# EAGLE design ProgrammateurFilPilote_1.2 (EAGLE 6.6.0)
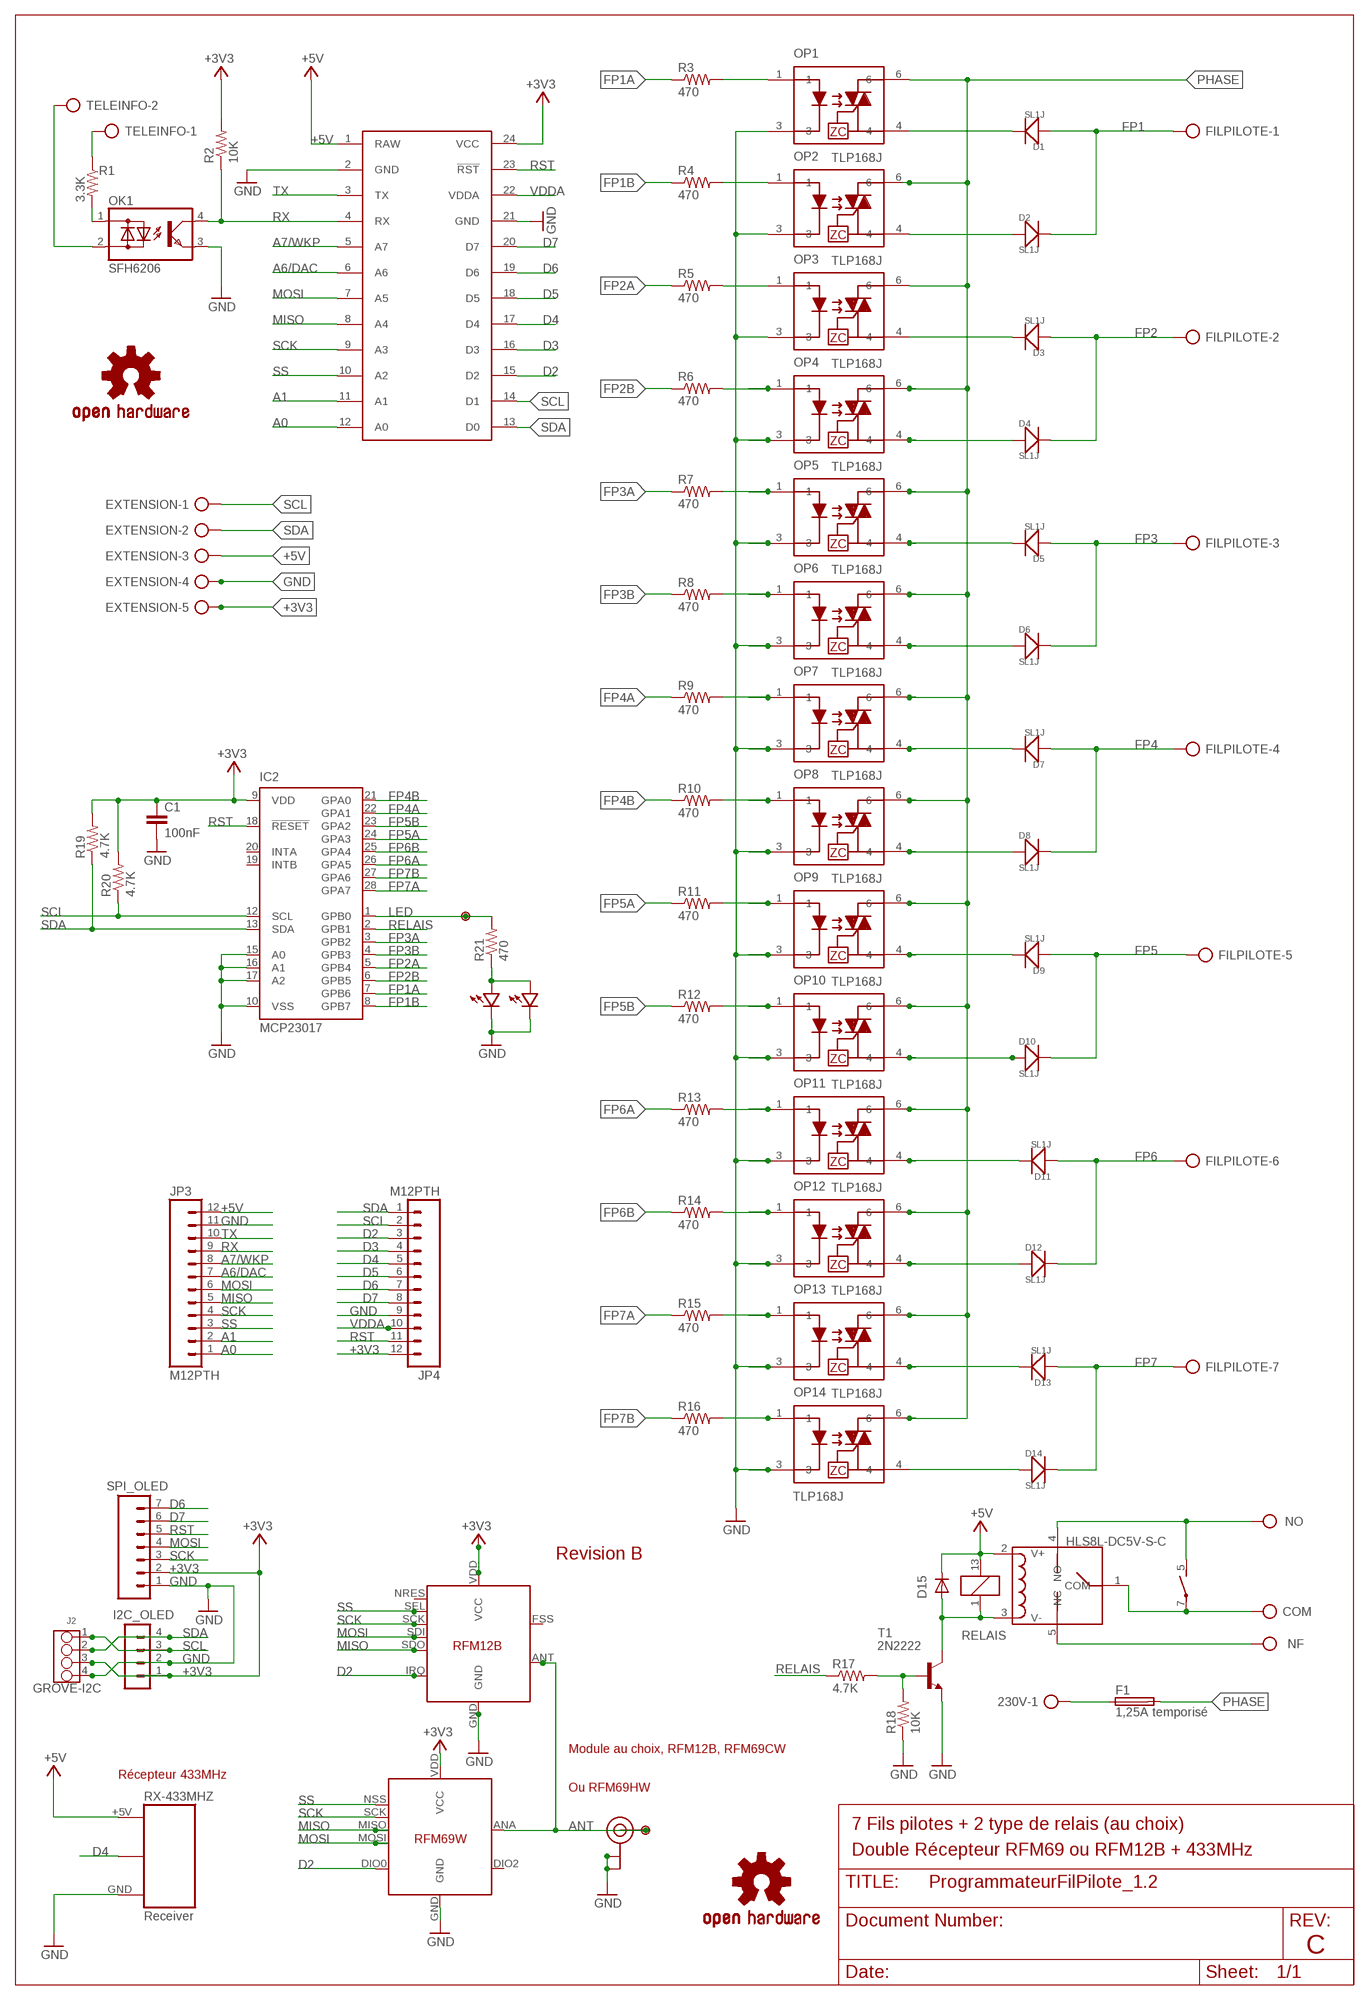
[diagram p0: schematic, sheet 1]

## Parts
230V  AK500/2  [AK500/2]
C1  100nF  CAP'1206-CAP'  [1206-CAP]
D1  SL1J  DIODE-SMA  [DO-214AC]
D2  SL1J  DIODE-SMA  [DO-214AC]
D3  SL1J  DIODE-SMA  [DO-214AC]
D4  SL1J  DIODE-SMA  [DO-214AC]
D5  SL1J  DIODE-SMA  [DO-214AC]
D6  SL1J  DIODE-SMA  [DO-214AC]
D7  SL1J  DIODE-SMA  [DO-214AC]
D8  SL1J  DIODE-SMA  [DO-214AC]
D9  SL1J  DIODE-SMA  [DO-214AC]
D10  SL1J  DIODE-SMA  [DO-214AC]
D11  SL1J  DIODE-SMA  [DO-214AC]
D12  SL1J  DIODE-SMA  [DO-214AC]
D13  SL1J  DIODE-SMA  [DO-214AC]
D14  SL1J  DIODE-SMA  [DO-214AC]
D15  CGRM4001-G  [SOD-123_MINI-SMA]
EXTENSION  AK500/5  [AK500/5]
F1  1,25A temporisé  TE5  [TE5]
FILPILOTE  AK500/7  [AK500/7]
I2C_OLED  CON_HEADER_1X04'SMALL''  [M1X4]
IC2  MCP23017  MCP23017SP  [DIL28-3]
J2  GROVE-I2C  GROVE-4P-2.0-3470130P1  [4P-2.0]
JP3  M12PTH  [1X12-SMALL-PADS]
JP4  M12PTH  [1X12-SMALL-PADS]
L  LED0805-LARGE  [0805-LED-LARGEPADS]
LED  LED3MMNOSILK  [LED3MM_NOSILK]
LOGO1  OSHW-LOGOL  [OSHW-LOGO-L]
LOGO2  OSHW-LOGOL  [OSHW-LOGO-L]
OK1  SFH6206  [DIL4-SMD]
OP1  TLP168J  TLP168JBIGPAD  [MFSOP-4-HANDSOLDER]
OP2  TLP168J  TLP168JBIGPAD  [MFSOP-4-HANDSOLDER]
OP3  TLP168J  TLP168JBIGPAD  [MFSOP-4-HANDSOLDER]
OP4  TLP168J  TLP168JBIGPAD  [MFSOP-4-HANDSOLDER]
OP5  TLP168J  TLP168JBIGPAD  [MFSOP-4-HANDSOLDER]
OP6  TLP168J  TLP168JBIGPAD  [MFSOP-4-HANDSOLDER]
OP7  TLP168J  TLP168JBIGPAD  [MFSOP-4-HANDSOLDER]
OP8  TLP168J  TLP168JBIGPAD  [MFSOP-4-HANDSOLDER]
OP9  TLP168J  TLP168JBIGPAD  [MFSOP-4-HANDSOLDER]
OP10  TLP168J  TLP168JBIGPAD  [MFSOP-4-HANDSOLDER]
OP11  TLP168J  TLP168JBIGPAD  [MFSOP-4-HANDSOLDER]
OP12  TLP168J  TLP168JBIGPAD  [MFSOP-4-HANDSOLDER]
OP13  TLP168J  TLP168JBIGPAD  [MFSOP-4-HANDSOLDER]
OP14  TLP168J  TLP168JBIGPAD  [MFSOP-4-HANDSOLDER]
P1  PADSMALL  [PAD-SMALL]
P2  PADSMALL  [PAD-SMALL]
R1  3.3K  RESISTOR'1206-RES''  [1206-RES]
R2  10K  RESISTOR'1206-RES''  [1206-RES]
R3  470  RESISTOR'1206-RES''  [1206-RES]
R4  470  RESISTOR'1206-RES''  [1206-RES]
R5  470  RESISTOR'1206-RES''  [1206-RES]
R6  470  RESISTOR'1206-RES''  [1206-RES]
R7  470  RESISTOR'1206-RES''  [1206-RES]
R8  470  RESISTOR'1206-RES''  [1206-RES]
R9  470  RESISTOR'1206-RES''  [1206-RES]
R10  470  RESISTOR'1206-RES''  [1206-RES]
R11  470  RESISTOR'1206-RES''  [1206-RES]
R12  470  RESISTOR'1206-RES''  [1206-RES]
R13  470  RESISTOR'1206-RES''  [1206-RES]
R14  470  RESISTOR'1206-RES''  [1206-RES]
R15  470  RESISTOR'1206-RES''  [1206-RES]
R16  470  RESISTOR'1206-RES''  [1206-RES]
R17  4.7K  RESISTOR'1206-RES''  [1206-RES]
R18  10K  RESISTOR'1206-RES''  [1206-RES]
R19  4.7K  RESISTOR'1206-RES''  [1206-RES]
R20  4.7K  RESISTOR'1206-RES''  [1206-RES]
R21  470  RESISTOR'1206-RES''  [1206-RES]
RELAIS  Relais G6D  G6D-1A-ASI12VDC  [G6D]
RL  AK500/2  [AK500/2]
RX-433MHZ  Receiver  RF-LINK_RX  [RF-LINK_RX]
SPARKCORE  SPARK_CORECORE  [SPARK_CORE]
SPI_OLED  CON_HEADER_1X07'SMALL'  [M1X7]
SW1  HLS8L-DC5V-S-C  RELAY-HLS8L-DC5V-S-C-315030000  [5P-L19.0XW15.0XH15.0MM]
T1  2N2222  2N2222-NPN-TO92-EBC  [TO92-EBC]
TELEINFO  AK500/2  [AK500/2]
U$2  RFM12B  [RFM12B-MINPADS]
U$3  RFM69W  [RFM69W-MINPADS]
U-FL  U.FL  [U.FL]

## Nets
+3V3: C1.1 EXTENSION.5 I2C_OLED.1 IC2.9(VDD) J2.3 JP4.12 R2.2 R19.2 R20.2 SPARKCORE.24(VCC) SPI_OLED.2 U$2.VDD(VCC) U$3.VDD(VCC)
+5V: D15.C EXTENSION.3 JP3.12 RELAIS.13 RX-433MHZ.+5V SPARKCORE.1(RAW) SW1.2(V+)
A0: JP3.1 SPARKCORE.12(A0)
A1: JP3.2 SPARKCORE.11(A1)
A6/DAC: JP3.7 SPARKCORE.6(A6)
A7/WKP: JP3.8 SPARKCORE.5(A7)
ANT: P1.1 U$2.ANT U$3.ANA(ANT) U-FL.3(SIGNAL)
COM: RELAIS.7(2:P) RL.1 SW1.1(COM)
D2: JP4.3 SPARKCORE.15(D2) U$2.IRQ U$3.DIO0
D3: JP4.4 SPARKCORE.16(D3)
D4: JP4.5 RX-433MHZ.DATA@1(DATA) RX-433MHZ.DATA@2(DATA) SPARKCORE.17(D4)
D5: JP4.6 SPARKCORE.18(D5)
D6: JP4.7 SPARKCORE.19(D6) SPI_OLED.7
D7: JP4.8 SPARKCORE.20(D7) SPI_OLED.6
FP1: D1.1(+) D2.2(-) FILPILOTE.1
FP1A: IC2.7(GPB6) R3.1
FP1B: IC2.8(GPB7) R4.1
FP2: D3.1(+) D4.2(-) FILPILOTE.2
FP2A: IC2.5(GPB4) R5.1
FP2B: IC2.6(GPB5) R6.1
FP3: D5.1(+) D6.2(-) FILPILOTE.3
FP3A: IC2.3(GPB2) R7.1
FP3B: IC2.4(GPB3) R8.1
FP4: D7.1(+) D8.2(-) FILPILOTE.4
FP4A: IC2.22(GPA1) R9.1
FP4B: IC2.21(GPA0) R10.1
FP5: D9.1(+) D10.2(-) FILPILOTE.5
FP5A: IC2.24(GPA3) R11.1
FP5B: IC2.23(GPA2) R12.1
FP6: D11.1(+) D12.2(-) FILPILOTE.6
FP6A: IC2.26(GPA5) R13.1
FP6B: IC2.25(GPA4) R14.1
FP7: D13.1(+) D14.2(-) FILPILOTE.7
FP7A: IC2.28(GPA7) R15.1
FP7B: IC2.27(GPA6) R16.1
GND: C1.2 EXTENSION.4 I2C_OLED.2 IC2.10(VSS) IC2.15(A0) IC2.16(A1) IC2.17(A2) J2.4 JP3.11 JP4.9 L.MINUS LED.MINUS OK1.3(E) OP1.3 OP2.3 OP3.3 OP4.3 OP5.3 OP6.3 OP7.3 OP8.3 OP9.3 OP10.3 OP11.3 OP12.3 OP13.3 OP14.3 R18.1 RX-433MHZ.GND SPARKCORE.2(GND) SPARKCORE.21(GND) SPI_OLED.1 T1.E U$2.GND U$3.GND U-FL.1(GND) U-FL.2(GND)
LED: IC2.1(GPB0) P2.1 R21.2
MISO: JP3.5 SPARKCORE.8(A4) U$2.SDO U$3.MISO
MOSI: JP3.6 SPARKCORE.7(A5) SPI_OLED.4 U$2.SDI U$3.MOSI
N$1: D1.2(-) OP1.4
N$2: D2.1(+) OP2.4
N$3: OK1.2(AC2) TELEINFO.2
N$4: OK1.1(AC1) R1.2
N$5: R1.1 TELEINFO.1
N$6: L.PLUS LED.PLUS R21.1
N$7: OP1.1 R3.2
N$8: OP2.1 R4.2
N$9: OP3.1 R5.2
N$10: OP4.1 R6.2
N$11: OP5.1 R7.2
N$12: OP6.1 R8.2
N$13: OP7.1 R9.2
N$14: OP8.1 R10.2
N$15: D15.A RELAIS.1 SW1.3(V-) T1.C
N$16: 230V.1 F1.1
N$19: OP9.1 R11.2
N$21: R17.2 R18.2 T1.B
N$22: D3.2(-) OP3.4
N$24: D5.2(-) OP5.4
N$25: D4.1(+) OP4.4
N$26: D7.2(-) OP7.4
N$29: D6.1(+) OP6.4
N$31: D8.1(+) OP8.4
N$32: OP10.1 R12.2
N$34: OP14.1 R16.2
N$42: D9.2(-) OP9.4
N$47: OP11.1 R13.2
N$48: OP12.1 R14.2
N$49: D10.1(+) OP10.4
N$51: D12.1(+) OP12.4
NF: RL.2 SW1.5(NC)
NO: 230V.2 RELAIS.5(2:S) SW1.4(NO)
PHASE: F1.2 OP1.6 OP2.6 OP3.6 OP4.6 OP5.6 OP6.6 OP7.6 OP8.6 OP9.6 OP10.6 OP11.6 OP12.6 OP13.6 OP14.6
RELAIS: IC2.2(GPB1) R17.1
RST: IC2.18(!RESET) JP4.11 SPARKCORE.23(!RST) SPI_OLED.5
RX: JP3.9 OK1.4(C) R2.1 SPARKCORE.4(RX)
S$1: D11.2(-) OP11.4
S$3: D13.2(-) OP13.4
S$5: OP13.1 R15.2
S$11: D14.1(+) OP14.4
SCK: JP3.4 SPARKCORE.9(A3) SPI_OLED.3 U$2.SCK U$3.SCK
SCL: EXTENSION.1 I2C_OLED.3 IC2.12(SCL) J2.1 JP4.2 R20.1 SPARKCORE.14(D1)
SDA: EXTENSION.2 I2C_OLED.4 IC2.13(SDA) J2.2 JP4.1 R19.1 SPARKCORE.13(D0)
SS: JP3.3 SPARKCORE.10(A2) U$2.SEL U$3.NSS(SEL)
TX: JP3.10 SPARKCORE.3(TX)
VDDA: JP4.10 SPARKCORE.22(VDDA)
Unconnected: IC2.19(INTB) IC2.20(INTA) U$2.FSS(FFS) U$2.NRES U$3.DIO2

## Notes on the sheet
- Revision B
- Module au choix, RFM12B, RFM69CW
- Récepteur 433MHz
- Ou RFM69HW
- 7 Fils pilotes + 2 type de relais (au choix)
- Double Récepteur RFM69 ou RFM12B + 433MHz
- C

## Library data of the parts
230V TELEINFO = con-ptr500:AK500/2: CONNECTOR; OC_FARNELL: unknown; OC_NEWARK: unknown
C1 = _c2h:CAP: Capacitor Standard 0603 ceramic capacitor, and 0.1" leaded capacitor.
D1-D14 = seeed-opl-Discrete:DIODE*
D15 = diode:CGRM400*-G: Molded plasitc,JEDEC SOD-123/Mini SMA Source: Comchip CGRM4001-G.pdf
EXTENSION = con-ptr500:AK500/5: CONNECTOR; OC_FARNELL: unknown; OC_NEWARK: unknown
F1 = fuse:TE5: FUSE Wickmann; OC_FARNELL: unknown; OC_NEWARK: unknown
FILPILOTE = con-ptr500:AK500/7: CONNECTOR; OC_FARNELL: unknown; OC_NEWARK: unknown
I2C_OLED = _c2h:CON_HEADER_1X04
IC2 = adafruit:MCP23017: http://ww1.microchip.com/downloads/en/DeviceDoc/21952a.pdf Source: http://ww1.microchip.com/downloads/en/DeviceDoc/21952a.pdf
J2 = seeed-opl-Connector:GROVE-4P-2.0
JP3 JP4 = Spark:M12: Header 12 Standard 12-pin 0.1" header. Use with straight break away headers (SKU : PRT-00116), right angle break away headers (PRT-00553), swiss pins (PRT-00743), machine pins (PRT-00117), and female headers (PRT-00115).
L LED = _c2h:LED
LOGO1 LOGO2 = SparkFun-Aesthetics:OSHW-LOGO: Open Source Hardware Logo This logo indicates the piece of hardware it is found on incorporates a OSHW license and/or adheres to the definition of open source hardware found here: http://freedomdefined.org/OSHW
OK1 = optocoupler:SFH620: Optocoupler, Phototransistor Output, AC Input Source: http://www.vishay.com/docs/83675/sfh620.pdf; MF: VISHAY/TELEFUNKEN; MPN: SFH6206-3; OC_FARNELL: 1469585; OC_NEWARK: 58K2214
OP1-OP14 = TLP168J:TLP168J
P1 P2 = SteveMarple:PAD
R1-R21 = _c2h:RESISTOR: Resistor Basic schematic elements and footprints for 0603, 1206, and PTH resistors.
RELAIS = relay:G6D?*: OMRON Slim, Miniature PCB Relay 17.5 × 6.5 × 12.5 mm with Socked Source: http://ecb.omron.com.sg/pdf/relay/power/G6D.pdf
RL = con-ptr500:AK500/2: CONNECTOR
RX-433MHZ = _c2h:RF-LINK_RX: RF Link receivers- WRL-8947, 8948, 8949, 8950, 10532, 10533
SPARKCORE = Spark:SPARK_CORE
SPI_OLED = _c2h:CON_HEADER_1X07
SW1 = seeed-opl-Connector:RELAY-HLS8L-DC5V-S-C
T1 = transistor-neu-to92:*-NPN-: NPN Transistror
U$2 = _c2h:RFM12B
U$3 = _c2h:RFM69W
U-FL = microbuilder:U.FL: U.FL Antenna Connector

## Net classes
0 default: width 0.203 mm, drill 0.356 mm, clearance 0.254 mm

## Board
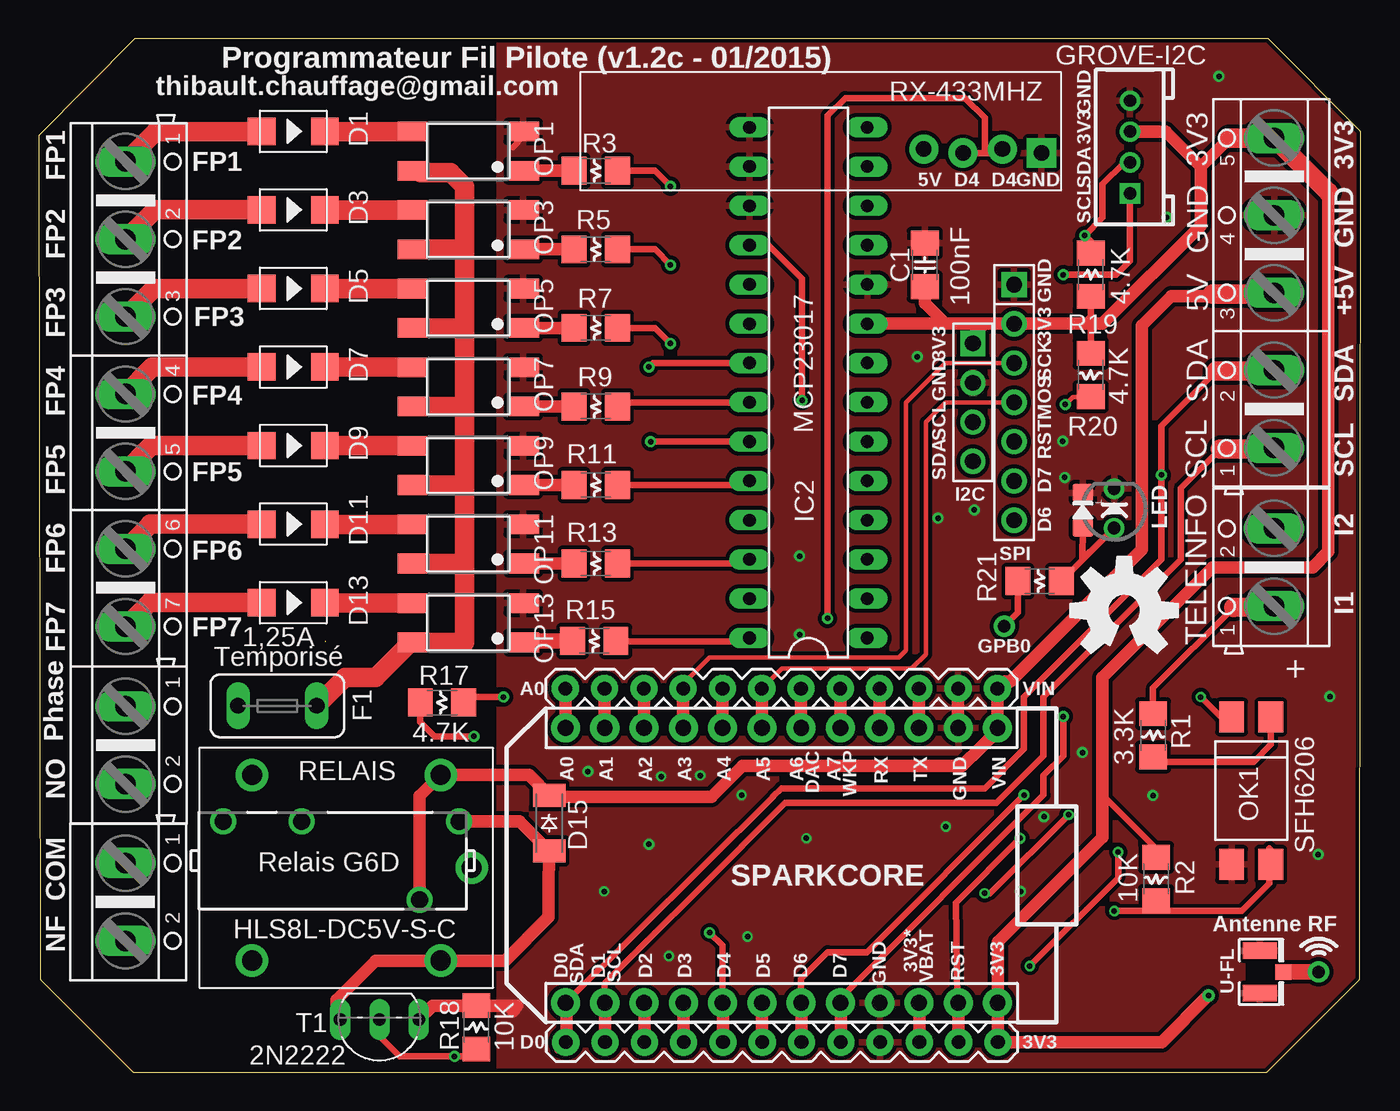
[diagram p1: board, top side]
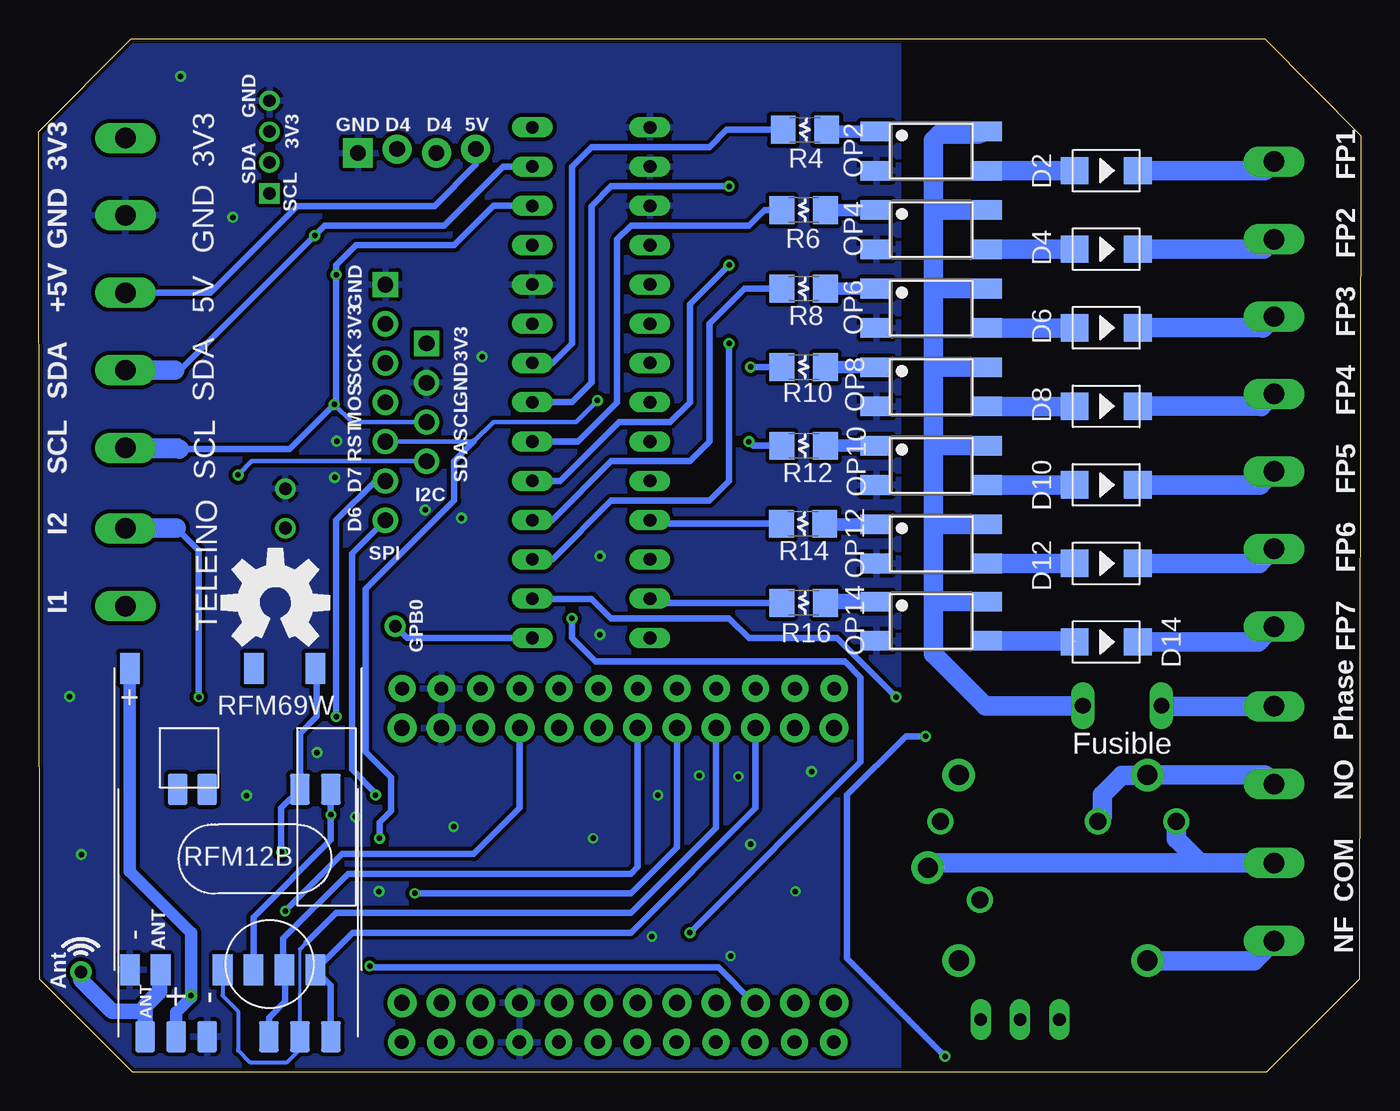
[diagram p2: board, bottom side, seen from below]

Size 85.49 x 66.83 mm. Coordinates in mm from the lower left corner, seen from the top.
Outline: 0,60.54 0.12,6.01 6.12,0 79.41,0 85.41,5.99 85.49,60.82 79.49,66.83 6.2,66.83 0,60.54
Copper layers (1*16): Top 0.035mm / dielectric 1.5mm / Bottom 0.035mm
Design rules "SeeedStudio_2layer_DRU_no_angle_20140221": minimum track width 6mil, minimum drill 12mil, track to track 6mil, track to pad 6mil, pad to pad 6mil, via to via 6mil, smd to smd 0mil, copper to edge 10mil, drill to drill 10mil, minimum pad ring 10mil, minimum via ring 6mil, stop-mask expansion 2mil, vias tented up to drill 100mil, thermal gap 10mil

### Footprints (pad centres in the part's own frame; a part is rotated, then mirrored left to right if it is on the bottom)
AK500/2 = drill 1.321 long: 1 -2.515,0; 2 2.515,0
1206-CAP = smd 1.6 x 1.8: 1 -1.4,0; 2 1.4,0
DO-214AC = smd 1.8 x 1.77: 1 -2.042,0; 2 2.042,0
SOD-123_MINI-SMA = smd 1.5 x 2.1: A 1.8,0; C -1.8,0
AK500/5 = drill 1.321 long: 1 -10.033,0; 2 -5.004,0; 3 0,0; 4 5.004,0; 5 10.008,0
TE5 = drill 1.016 long: 1 -2.54,0; 2 2.54,0
AK500/7 = drill 1.321 long: 1 -15.037,0; 2 -10.008,0; 3 -5.004,0; 4 0,0; 5 5.004,0; 6 10.008,0; 7 15.037,0
M1X4 = drill 1.02 pad 1.632 square: 1 -3.81,0 | drill 1.02 pad 1.632: 2 -1.27,0; 3 1.27,0; 4 3.81,0
DIL28-3 = drill 0.813 long: 1 -16.51,-3.81; 2 -13.97,-3.81; 3 -11.43,-3.81; 4 -8.89,-3.81; 5 -6.35,-3.81; 6 -3.81,-3.81; 7 -1.27,-3.81; 8 1.27,-3.81; 9 3.81,-3.81; 10 6.35,-3.81; 11 8.89,-3.81; 12 11.43,-3.81; 13 13.97,-3.81; 14 16.51,-3.81; 15 16.51,3.81; 16 13.97,3.81; 17 11.43,3.81; 18 8.89,3.81; 19 6.35,3.81; 20 3.81,3.81; 21 1.27,3.81; 22 -1.27,3.81; 23 -3.81,3.81; 24 -6.35,3.81; 25 -8.89,3.81; 26 -11.43,3.81; 27 -13.97,3.81; 28 -16.51,3.81
4P-2.0 = drill 0.8 pad 1.27 square: 1 -3,0 | drill 0.8 pad 1.27: 2 -1,0; 3 1,0; 4 3,0
1X12-SMALL-PADS = drill 0.889 pad 1.753: 1 0,0; 2 2.54,0; 3 5.08,0; 4 7.62,0; 5 10.16,0; 6 12.7,0; 7 15.24,0; 8 17.78,0; 9 20.32,0; 10 22.86,0; 11 25.4,0; 12 27.94,0
0805-LED-LARGEPADS = smd 1.156 x 1.3: MINUS -1.127,0; PLUS 1.127,0
LED3MM_NOSILK = drill 0.813: MINUS 1.27,0; PLUS -1.27,0
DIL4-SMD = smd 1.6 x 2: 1 -1.27,-4.77; 2 1.27,-4.77; 3 1.27,4.77; 4 -1.27,4.77
MFSOP-4-HANDSOLDER = smd 1.27 x 2.032: 1 2.54,0.381; 3 0,0.381; 4 0,-6.731; 6 2.54,-6.731
PAD-SMALL = drill 0.813 pad 1.372: 1 0,0
1206-RES = smd 1.6 x 1.8: 1 -1.4,0; 2 1.4,0
G6D = drill 1.1 pad 1.676: 1 8.08,2.5; 5 -2.08,2.5; 7 -7.16,2.5; 13 5.54,-2.58
RF-LINK_RX = drill 1.016 pad 1.88: +5V 7.62,1.143; DATA@1 2.54,1.143; DATA@2 5.08,1.397 | drill 1.016 pad 1.88 square: GND 0,1.397
SPARK_CORE = drill 1.016 pad 1.88: 1 -8.89,13.97; 2 -8.89,11.43; 3 -8.89,8.89; 4 -8.89,6.35; 5 -8.89,3.81; 6 -8.89,1.27; 7 -8.89,-1.27; 8 -8.89,-3.81; 9 -8.89,-6.35; 10 -8.89,-8.89; 11 -8.89,-11.43; 12 -8.89,-13.97; 13 8.89,-13.97; 14 8.89,-11.43; 15 8.89,-8.89; 16 8.89,-6.35; 17 8.89,-3.81; 18 8.89,-1.27; 19 8.89,1.27; 20 8.89,3.81; 21 8.89,6.35; 22 8.89,8.89; 23 8.89,11.43; 24 8.89,13.97
M1X7 = drill 1.02 pad 1.632 square: 1 -6.35,0 | drill 1.02 pad 1.632: 2 -3.81,0; 3 -1.27,0; 4 1.27,0; 5 3.81,0; 6 6.35,0; 7 8.89,0
5P-L19.0XW15.0XH15.0MM = drill 1.3 pad 2.1: 1 -8.1,0; 2 -6.1,-6; 3 -6.1,6; 4 6.1,-6; 5 6.1,6
TO92-EBC = drill 0.813 long: B 0,-1.27; C 2.54,-1.27; E -2.54,-1.27
RFM12B-MINPADS = smd 2 x 1.27: ANT 8,-6; FSS -8.002,-2; GND 8,-2; IRQ -8,4; NRES -8.002,-3.905; SCK 8,4; SDI 8,2; SDO -8,6; SEL 8,6; VDD 8,-4
RFM69W-MINPADS = smd 2 x 1.27: ANA 8,-5; DIO0 -11.5,5; DIO2 -11.5,1.012; GND 8,-7; MISO 8,1; MOSI 8,3; NSS 8,5; SCK 8,-1; VDD -11.5,-7
U.FL = smd 2.2 x 1.05: 1 0,1.375; 2 0,-1.375 | smd 1.05 x 1: 3 1.525,0

### Placement (x,y rotation side)
230V  5.62,21.14 270 top
C1  57.3,52.2 90 top
D1  16.47,60.84 0 top
D2  16.47,58.3 0 bottom
D3  16.47,55.76 0 top
D4  16.47,53.22 0 bottom
D5  16.47,50.68 0 top
D6  16.47,48.14 0 bottom
D7  16.47,45.6 0 top
D8  16.47,43.06 0 bottom
D9  16.47,40.52 0 top
D10  16.47,37.98 0 bottom
D11  16.47,35.44 0 top
D12  16.47,32.9 0 bottom
D13  16.47,30.36 0 top
D14  16.47,27.82 0 bottom
D15  33.01,16.1 270 top
EXTENSION  79.89,50.4 90 top
F1  15.43,23.69 0 top
FILPILOTE  5.62,43.85 270 top
I2C_OLED  60.41,43.31 270 top
IC2  49.78,44.59 90 top
J2  70.57,59.82 90 top
JP3  34.06,24.8 0 top
JP4  34.09,1.94 0 top
L  67.52,36.33 270 top
LED  69.55,36.45 90 top
LOGO1  70.19,29.85 0 top
LOGO2  70.19,30.36 0 bottom
OK1  78.41,18.2 180 top
OP1  30.94,60.83 270 top
OP2  30.94,58.29 90 bottom
OP3  30.94,55.75 270 top
OP4  30.94,53.21 90 bottom
OP5  30.94,50.66 270 top
OP6  30.94,48.12 90 bottom
OP7  30.94,45.59 270 top
OP8  30.94,43.05 90 bottom
OP9  30.94,40.51 270 top
OP10  30.94,37.97 90 bottom
OP11  30.94,35.43 270 top
OP12  30.94,32.89 90 bottom
OP13  30.94,30.32 270 top
OP14  30.94,27.88 90 bottom
P1  82.76,6.48 0 top
P2  62.44,28.83 0 top
R1  72.06,21.78 270 top
R2  72.26,12.49 90 top
R3  36.02,58.29 180 top
R4  35.94,60.93 0 bottom
R5  36.02,53.21 180 top
R6  36.02,55.75 0 bottom
R7  36.02,48.12 180 top
R8  36.02,50.66 0 bottom
R9  36.02,43.05 180 top
R10  36.02,45.59 0 bottom
R11  36.02,37.97 180 top
R12  36.02,40.51 0 bottom
R13  36.02,32.89 180 top
R14  36.07,35.46 0 bottom
R15  35.92,27.88 180 top
R16  36.02,30.34 0 bottom
R17  26.08,23.89 180 top
R18  28.3,2.9 270 top
R19  68.03,51.57 270 top
R20  68.03,45.09 90 top
R21  64.73,31.75 180 top
RELAIS  19.09,13.71 0 top
RL  5.61,11 270 top
RX-433MHZ  64.85,60.84 180 top
SPARKCORE  48.03,13.37 270 top
SPI_OLED  63.07,44.58 270 top
SW1  19.89,13.21 180 top
T1  22.03,2.13 180 top
TELEINFO  79.89,32.65 90 top
U$2  72.6,10.29 270 bottom
U$3  72.6,14.61 270 bottom
U-FL  78.95,6.48 0 top

### Tracks (layer width: path | path; a pad name or v marks a point on that pad's centre or on a via)
+3V3  (via drill 0.36 pad 0.81)
  Top 0.406: 62.03,7.75 62.09,7.78 | R2.2 72.26,14.44 68.79,17.91 | 67.52,48.39 68.03,48.9 R19.2 R20.2
  Top 0.813: v75.65,4.96 72.63,1.94 JP4.12 62.03,4.45 SPARKCORE.24 62.03,4.5 62.03,7.75 62.03,8.42 68.79,15.18 68.79,17.91 68.79,25.53 75.9,32.64 82.38,32.64 83.39,33.66 83.39,56.9 | 55.53,48.4 IC2.9 58.63,48.39 | 61.17,48.39 SPI_OLED.2 67.52,48.39 68.79,48.39 75.14,54.74 75.14,58.55 | 61.17,48.39 58.63,48.39 | I2C_OLED.1 60.41,47.63 61.17,48.39 | C1.1 57.3,49.72 58.63,48.39 | 77,60.41 75.14,58.55 | J2.3 72.87,60.82 75.14,58.55
  Top 1.27: 83.39,56.9 EXTENSION.5 77,60.41
  Bottom 0.813: U$3.VDD 79.6,12.97 75.65,9.02 v75.65,4.96 75.65,4.83 76.6,3.88 U$2.VDD
+5V
  Top 0.406: JP3.12
  Top 0.813: JP3.12 61.99,22.26 SPARKCORE.1 62.11,22.15 59.71,19.8 45.51,19.8 43.5,17.79 33.11,17.79 D15.C 31.7,19.21 SW1.2 24.63,17.85 RELAIS.13 | JP3.12 61.99,25.09 | 75.9,50.3 75.77,50.17 73.23,50.17 71.33,48.26 71.33,33.79 62.82,25.28 62.47,25.28 JP3.12 | 62.06,24.86 JP3.12
  Top 1.27: 75.9,50.3 79.78,50.3 EXTENSION.3
  Bottom 0.406: 79.91,50.42 74.38,50.42 68.79,56.01 59.9,56.01 57.23,58.68 RX-433MHZ.+5V
  Bottom 0.61: 79.91,50.42 EXTENSION.3
A0
  Top 0.406: 34.02,22.3 SPARKCORE.12 34.06,22.26
  Top 0.813: JP3.1 34.06,22.26
A1
  Top 0.406: 36.56,22.3 SPARKCORE.11 36.6,22.26
  Top 0.813: JP3.2 36.6,22.26
A6/DAC
  Top 0.406: 49.26,22.3 49.3,22.26 SPARKCORE.6
  Top 0.813: JP3.7 49.3,22.26
A7/WKP
  Top 0.406: 51.8,22.3 51.84,22.26 SPARKCORE.5
  Top 0.813: JP3.8 51.84,22.26
ANT
  Top 1.016: U-FL.3 P1.1
  Bottom 1.016: U$2.ANT 78.6,3.69 | 78.6,3.69 78.6,4.29 77.68,5.21 77.68,6.53 U$3.ANA | P1.1 82.76,5.97 80.73,3.94 78.85,3.94 78.6,3.69
COM
  Bottom 1.27: 10.37,13.52 RL.1 9.49,13.52 | 10.37,13.52 27.46,13.52 27.99,12.99 | SW1.1 27.99,12.99 | 27.99,12.99 28.15,12.83 | RELAIS.7 11.93,15.08 10.37,13.52
D2  (via drill 0.36)
  Top 0.406: 39.17,4.45 SPARKCORE.15 | v69.81,14.23 69.81,12.58 v64.09,6.86
  Top 0.813: JP4.3 39.17,4.45
  Bottom 0.406: SPARKCORE.15 39.26,4.47 41.55,6.77 64,6.77 v64.09,6.86 | U$3.DIO0 67.52,26.03 67.52,22.99 68.6,21.91 U$2.IRQ 69.81,17.08 v69.81,14.23
D3
  Top 0.406: 41.68,1.96 JP4.4
  Top 0.813: 41.68,1.96 SPARKCORE.16
D4  (via drill 0.36 pad 0.71)
  Top 0.406: 44.25,4.45 SPARKCORE.17 44.22,8.19 v43.39,9.02 | v51.01,29.34 51.01,61.85 52.15,63 59.9,63 61.17,61.73 61.17,59.44 RX-433MHZ.DATA@2 62.19,59.44 RX-433MHZ.DATA@1
  Top 0.813: JP4.5 44.25,4.45
  Bottom 0.406: v51.01,29.34 51.01,28.07 49.49,26.55 33.36,26.55 32.34,25.53 32.34,20.07 v43.39,9.02
D5
  Top 0.406: 46.85,4.39 SPARKCORE.18 46.79,4.45
  Top 0.813: JP4.6 46.79,4.45
D6  (via drill 0.36 pad 0.71)
  Top 0.406: 49.33,4.45 SPARKCORE.19 49.3,6.04 51.01,7.75 53.55,7.75 v63.71,17.91
  Top 0.813: JP4.7 49.33,4.45
  Bottom 0.406: v63.71,17.91 63.71,18.04 65.23,19.56 65.23,33.53 SPI_OLED.7
D7  (via drill 0.36 pad 0.71)
  Top 0.406: 51.87,4.45 SPARKCORE.20 51.84,4.77 64.98,17.91 64.98,19.18 66.25,20.45 v66.25,22.99
  Top 0.813: JP4.8 51.87,4.45
  Bottom 0.406: SPI_OLED.6 63.71,38.23 66.25,35.69 v66.25,22.99
FP1
  Top 1.27: FILPILOTE.1 7.56,60.83 14.42,60.83 D1.1
  Bottom 1.27: FILPILOTE.1 6.22,58.29 6.23,58.3 D2.2
FP1A  (via drill 0.36 pad 0.71)
  Top 0.406: 37.5,58.23 R3.1 39.84,58.29 v40.85,57.28
  Bottom 0.406: IC2.7 51,43.32 49.74,44.58 49.74,56.01 48.47,57.28 v40.85,57.28
FP1B
  Bottom 0.406: IC2.8 52.27,45.86 51.01,47.12 51.01,58.55 49.74,59.82 42.12,59.82 41.01,60.93 R4.1
FP2
  Top 1.27: FILPILOTE.2 7.51,55.75 7.51,55.76 D3.1
  Bottom 1.27: FILPILOTE.2 6.27,53.21 6.28,53.22 D4.2
FP2A  (via drill 0.36 pad 0.71)
  Top 0.406: R5.1 39.84,53.21 v40.85,52.2
  Bottom 0.406: v40.85,52.2 43.39,49.66 43.39,43.31 44.66,42.04 47.96,42.04 51.77,38.23 IC2.5
FP2B
  Bottom 0.406: IC2.6 50.62,40.78 48.09,43.31 48.09,53.85 47.2,54.74 39.58,54.74 38.57,55.75 R6.1
FP3
  Top 1.27: FILPILOTE.3 7.43,50.66 7.43,50.68 D5.1
  Bottom 1.27: 6.35,48.12 FILPILOTE.3 6.34,48.14 D6.2
FP3A  (via drill 0.36 pad 0.71)
  Top 0.406: 37.49,48.17 R7.1 39.84,48.12 v40.85,47.12
  Bottom 0.406: v40.85,47.12 40.85,38.23 42.12,36.96 48.47,36.96 52.27,33.16 IC2.3
FP3B
  Bottom 0.406: 37.49,50.71 R8.1 39.84,50.66 42.12,48.39 42.12,40.77 43.39,39.5 48.47,39.5 52.27,35.7 IC2.4
FP4
  Top 1.27: FILPILOTE.4 7.35,45.59 7.35,45.6 D7.1
  Bottom 1.27: FILPILOTE.4 6.42,43.05 6.44,43.06 D8.2
FP4A
  Top 0.406: R9.1 37.71,43.31 45.83,43.31 IC2.22
FP4B  (via drill 0.36 pad 0.71)
  Top 0.406: IC2.21 39.71,45.86 v39.45,45.6
  Bottom 0.406: v39.45,45.6 37.46,45.6 R10.1
FP5
  Top 1.27: FILPILOTE.5 7.28,40.51 7.28,40.52 D9.1
  Bottom 0.813: 5.73,38.86 FILPILOTE.5
  Bottom 1.27: 6.5,37.97 6.49,37.98 | 6.49,37.98 FILPILOTE.5 | D10.2 6.49,37.98
FP5A
  Top 0.406: R11.1 45.57,37.97 IC2.24
FP5B  (via drill 0.36 pad 0.71)
  Top 0.406: v39.58,40.77 IC2.23
  Bottom 0.406: R12.1 39.31,40.51 v39.58,40.77
FP6
  Top 1.27: FILPILOTE.6 7.2,35.43 7.2,35.44 D11.1
  Bottom 1.27: 6.58,32.89 6.57,32.9 | 6.57,32.9 FILPILOTE.6 | D12.2 6.57,32.9
FP6A
  Top 0.406: R13.1 45.57,32.89 IC2.26
FP6B
  Bottom 0.406: R14.1 45.73,35.46 IC2.25
FP7
  Top 1.27: FILPILOTE.7 7.23,30.43 7.23,30.36 D13.1
  Bottom 1.27: FILPILOTE.7 6.46,27.97 6.62,27.82 D14.2
FP7A
  Top 0.406: 37.37,27.86 45.62,27.86 IC2.28
  Top 0.61: 37.37,27.86 R15.1
FP7B
  Bottom 0.406: R16.1 45.69,30.34 IC2.27
GND  (via drill 0.36, 0.36 pad 0.71)
  Top 0.305: OK1.3
  Top 0.406: OP1.3 30.94,60.08 30.69,59.82 | 59.45,22.26 SPARKCORE.2
  Top 0.813: OP3.3 30.97,55.75 | JP3.11 59.45,22.26 | 30.69,3.94 30.92,4.3 R18.1 25.47,4.3 T1.E
  other vias: 45.45,17.91 40.25,19.12 42.79,19.18 49.64,15.12 36.56,11.69 83.49,24.29 82.73,14.07 63.49,11.69 76.31,64.39 58.15,35.82 72.06,17.88 67.49,20.67 58.66,15.88 66.35,38.45 49.2,28.29 65.01,16.51 60.5,36.36 56.82,46.26 66.22,40.8 45.83,8.77 40.75,7.5 35.52,19.43 49.2,33.37 39.45,14.74 72.95,55.28
  pour Bottom: 87.84,68.71 87.84,-2.41 29.93,-2.54 29.93,68.58
  pour Top: 29.8,67.31 86.57,67.44 86.57,-1.14 29.8,-1.27
LED
  Top 0.406: R21.2 63.33,30.87 63.33,29.72 P2.1
  Bottom 0.406: IC2.1 54.82,28.07 61.68,28.07 P2.1
MISO  (via drill 0.36)
  Top 0.406: 44.18,22.3 SPARKCORE.8 44.21,22.26 | v61.17,11.56 61.52,11.56 v66.6,16.64
  Top 0.813: JP3.5 44.21,22.26
  Bottom 0.406: SPARKCORE.8 44.22,14.54 47.2,11.56 v61.17,11.56 | 71.33,6.88 U$3.MISO 71.6,10.02 66.6,15.02 v66.6,16.64 U$2.SDO
MOSI
  Top 0.305: JP3.6 48.06,26.1 56.44,26.1 57.36,27.02 57.36,42.04 58.63,43.31 SPI_OLED.4
  Top 0.406: 46.72,22.3 SPARKCORE.7 46.75,22.26
  Top 0.813: JP3.6 46.75,22.26
  Bottom 0.406: SPARKCORE.7 46.76,13.27 47.2,12.83 65.49,12.83 69.68,8.64 69.68,6.69 U$3.MOSI 69.55,6.56 69.55,4.58 70.6,3.53 U$2.SDI | JP3.6 46.75,25.09
N$1
  Top 1.27: OP1.4 18.51,60.83 D1.2
N$2
  Bottom 1.27: OP2.4 18.51,58.29 D2.1
N$3  (via drill 0.36)
  Top 0.406: OK1.2 76.43,22.97 v75.14,24.26
  Bottom 0.406: 76.6,35.18 75.14,33.72 v75.14,24.26
  Bottom 0.61: 76.41,34.99 76.6,35.18
  Bottom 1.27: 76.6,35.18 78.07,35.18 TELEINFO.2
N$4
  Top 0.406: OK1.1 | OK1.1 | OK1.1 79.68,21.18 78.57,20.07 72.34,20.07 R1.2
N$5
  Top 0.406: R1.1 72.06,24.84 77.27,30.06
  Top 1.27: 77.27,30.06 TELEINFO.1
N$6
  Top 0.406: R21.1 69.43,35.05 LED.PLUS 67.5,33.17 L.PLUS
N$7
  Top 0.813: OP1.1 R3.2
N$8
  Bottom 0.813: OP2.1 33.9,60.83 R4.2
N$9
  Top 0.813: OP3.1 R5.2
N$10
  Bottom 0.813: OP4.1 R6.2
N$11
  Top 0.813: OP5.1 R7.2
N$12
  Bottom 0.813: OP6.1 R8.2
N$13
  Top 0.813: OP7.1 R9.2
N$14
  Bottom 0.813: R10.2 OP8.1
N$15
  Top 0.813: T1.C 19.26,3.63 19.26,4.67 21.8,7.21 SW1.3 30.15,7.21 32.98,10.04 32.98,11.73 D15.A 31.1,16.21 RELAIS.1
N$16
  Bottom 1.27: 230V.1 12.86,23.66 F1.1
N$19
  Top 0.813: OP9.1 R11.2
N$21  (via drill 0.36 pad 0.71)
  Top 0.406: T1.B 22.03,2.31 23.32,1.02 v26.88,1.02 27.82,1.02 R18.2 | R17.2 24.68,22.65 25.61,21.72 v28.15,21.72
  Top 0.813: 24.57,23.81 R17.2
  Bottom 0.406: v28.15,21.72 29.42,21.72 33.23,17.91 33.23,7.37 v26.88,1.02
N$22
  Top 1.27: OP3.4 18.51,55.75 D3.2
N$24
  Top 1.27: OP5.4 18.51,50.66 D5.2
N$25
  Bottom 1.27: OP4.4 18.51,53.21 D4.1
N$26
  Top 1.27: OP7.4 18.51,45.59 D7.2
N$29
  Bottom 1.27: OP6.4 18.51,48.12 D6.1
N$31
  Bottom 1.27: OP8.4 18.51,43.05 D8.1
N$32
  Bottom 0.813: R12.2 OP10.1
N$34
  Bottom 1.016: OP14.1 34.01,30.43 R16.2
N$42
  Top 1.27: OP9.4 18.51,40.51 D9.2
N$47
  Top 0.813: OP11.1 R13.2
N$48
  Bottom 0.813: OP12.1 34.61,35.43 R14.2
N$49
  Bottom 1.27: OP10.4 18.51,37.97 D10.1
N$51
  Bottom 1.27: OP12.4 18.51,32.89 D12.1
NF
  Bottom 1.27: SW1.5 6.88,7.21 RL.2
NO
  Bottom 1.27: 230V.2 6.2,19.21 SW1.4 13.83,19.18 15.45,19.18 16.72,17.91 16.72,16.5 RELAIS.5
PHASE
  Top 0.813: 26.99,37.97 27.53,38.5 | 27.53,43.5 27.07,43.05 27.57,43.05 27.63,43.1 | 27.63,47.2 27.53,47.1
  Top 1.27: OP7.6 27.07,43.05 | OP9.6 26.99,37.97 | OP11.6 27.53,32.89 | 27.53,32.89 27.53,38.5 27.53,43.5 27.53,47.1 27.53,48.39 | 27.53,32.89 27.53,27.79 OP13.6 24.05,27.79 21.8,25.53 19.81,25.53 F1.2 | 27.53,48.39 27.53,53.47 | 27.53,53.47 27.53,57.27 26.63,58.17 24.71,58.17 OP1.6 | OP3.6 27.26,53.21 27.53,53.47 | OP5.6 27.26,48.12 27.53,48.39
  Bottom 0.813: 26.97,55.75 27.63,56.4 | 27.62,40.51 27.63,40.5 | 27.51,45.59 27.63,45.7 | 27.6,35.43 27.63,35.4 | OP14.6 24.53,30.43
  Bottom 1.27: 27.63,50.93 27.63,56.4 27.63,60.26 27.24,60.65 24.77,60.65 OP2.6 | 27.63,50.93 27.63,45.7 27.63,40.5 27.63,35.9 | 27.63,35.9 27.63,35.4 27.63,30.43 27.51,30.43 | OP4.6 26.97,55.75 | OP10.6 27.62,40.51 | OP8.6 27.51,45.59 | OP12.6 27.6,35.43 | 27.53,35.8 27.63,35.9 | OP14.6 27.51,30.43 | F1.2 24.27,23.69 27.64,27.05 27.64,30.3 27.51,30.43 | OP6.6 27.36,50.66 27.63,50.93
RELAIS  (via drill 0.36 pad 0.71)
  Top 0.406: v30.05,24.26 27.86,24.26 R17.1
  Bottom 0.406: IC2.2 49.74,30.61 48.47,29.34 40.85,29.34 39.58,28.07 33.86,28.07 v30.05,24.26
RST  (via drill 0.36 pad 0.71)
  Top 0.406: 59.49,4.45 SPARKCORE.23 59.42,4.52 59.3,10.96 v63.46,15.12 | v49.36,43.44 49.36,51.31 47.19,53.48 IC2.18
  Top 0.813: JP4.11 59.49,4.45
  Bottom 0.305: SPI_OLED.5 57.36,40.77 56.09,42.04 50.76,42.04 v49.36,43.44
  Bottom 0.406: v63.46,15.12 63.46,16.13 62.69,16.89 62.69,19.05 64.34,20.7 64.34,31.24 58.63,36.96 58.63,39.5 57.36,40.77
RX  (via drill 0.36)
  Top 0.406: 54.38,22.26 SPARKCORE.4 | 79.58,14.48 79.68,14.39 OK1.4 79.58,13.33 79.58,12.2 77.81,10.42 72.6,10.42 | v69.55,10.42 72.6,10.42 | R2.1 72.26,10.76 72.6,10.42
  Top 0.813: JP3.9 54.38,22.26
  Bottom 0.406: SPARKCORE.4 54.38,17.07 57.36,14.1 65.87,14.1 v69.55,10.42
S$1
  Top 1.27: OP11.4 18.51,35.43 D11.2
S$3
  Top 1.27: OP13.4 18.51,30.32 D13.2
S$5
  Top 0.61: 31.04,27.88 OP13.1
  Top 1.016: R15.2 31.04,27.88
S$11  (1 unrouted)
  Bottom 0.813: OP14.4 24.39,27.88
  Bottom 1.27: 18.51,27.88 OP14.4
SCK
  Top 0.305: JP3.4 41.67,25.09 43.39,26.8 55.61,26.8 56.09,27.28 56.09,43.31 58.63,45.85 SPI_OLED.3
  Top 0.406: 41.64,22.3 SPARKCORE.9 41.67,22.26
  Top 0.813: JP3.4 41.67,22.26
  Bottom 0.203: 68.6,5.05 68.6,7.94
  Bottom 0.254: 68.6,1.46 69.42,0.64 71.84,0.64 72.6,1.4 72.6,3.94 73.6,4.94 U$3.SCK | 68.6,7.94 68.15,8.39 67.52,9.02 | 68.6,2.83 68.6,5.05
  Bottom 0.406: SPARKCORE.9 41.68,15.81 47.2,10.29 66.25,10.29 68.15,8.39 | 68.6,1.46 U$2.SCK 68.6,2.83
SCL  (via drill 0.36 pad 0.71)
  Top 0.305: 68.43,43.67 66.86,43.67 v66.38,43.18
  Top 0.406: 36.63,4.45 SPARKCORE.14 36.6,5.73 45.49,14.61 45.49,14.63 46.76,15.91 48.25,17.4 61.93,17.4 64.98,20.45 64.98,24.26 73.87,33.15 73.87,37.78 76.39,40.3 | R20.1 68.43,43.67 | J2.1 70.57,52.45 69.68,51.57 v66.25,51.57
  Top 0.813: JP4.2 36.63,4.45
  Top 1.27: 76.39,40.3 79.83,40.3 EXTENSION.1
  Bottom 0.305: I2C_OLED.3 65.23,42.04 v66.38,43.18
  Bottom 0.406: 76.41,40.77 79.49,40.77 EXTENSION.1 | IC2.12 56.08,56.02 58.63,53.47 64.98,53.47 66.25,52.2 v66.25,51.57 66.25,43.31 v66.38,43.18 69.26,40.3 76.39,40.3
  Bottom 1.27: EXTENSION.1 76.39,40.3
SDA  (via drill 0.36 pad 0.71)
  Top 0.406: SPARKCORE.13 47.49,17.8 47.49,17.82 48.03,18.35 61.17,18.35 63.71,20.89 63.71,24.26 72.6,33.15 v72.6,38.61 72.6,41.79 76.16,45.34 | 34.09,4.45 SPARKCORE.13 | 34.12,4.42 SPARKCORE.13 | 34.12,1.88 34.09,1.91 JP4.1 33.55,1.4 | R19.1 68.03,53.72 v67.65,54.11 68.79,55.25 68.79,57.41 70.2,58.82 J2.2
  Top 0.813: 34.12,1.88 34.12,4.42
  Top 1.27: 76.16,45.34 79.84,45.34 EXTENSION.2
  Bottom 0.305: I2C_OLED.4 71.71,39.5 v72.6,38.61
  Bottom 0.406: EXTENSION.2 79.84,45.34 76.41,45.34 v67.65,54.11 67.01,54.74 59.26,54.74 55.45,58.55 IC2.13
  Bottom 1.27: EXTENSION.2 76.71,45.4
SS
  Top 0.406: 39.1,22.3 SPARKCORE.10 39.13,22.26
  Top 0.813: JP3.3 39.13,22.26
  Bottom 0.406: SPARKCORE.10 39.14,17.07 47.2,9.02 65.19,9.02 U$3.NSS 66.6,5.61 U$2.SEL
TX
  Top 0.406: 56.92,22.26 SPARKCORE.3
  Top 0.813: JP3.10 56.92,22.26
VDDA
  Top 0.406: 56.95,4.45 SPARKCORE.22
  Top 0.813: JP4.10 56.95,4.45

### Text on the board
tPlace: Programmateur Fil Pilote (v1.2c - 01/2015) | thibault.chauffage@gmail.com
tNames: GND | 3V3 | 3V3 | FP1 | 3V3 | SDA | FP1 | 5V | D4 | D4 | GND | SCL | GND | GND | FP2 | FP2 | +5V | FP3 | 5V | GND | FP3 | 3V3 | SDA | SDA | FP4 | 3V3 | SCK | FP4 | GND | MOS | SCL | SCL | SCL | FP5 | RST | FP5 | SDA | I2C | D7 | I2 | FP6 | D6 | FP6 | SPI | I1 | FP7 | FP7 | GPB0 | Phase | 1,25A | + | Temporisé | A0 | VIN | DAC | WKP | NO | A0 | A1 | A2 | A3 | A4 | A5 | A6 | A7 | RX | TX | GND | VIN | COM | NF | 3V3* | VBAT | Antenne RF | D0 | SDA | D1 | SCL | D2 | D3 | D4 | D5 | D6 | D7 | GND | RST | 3V3 | D0 | 3V3
bNames: 5V | D4 | D4 | GND | GND | FP1 | 3V3 | 3V3 | SDA | SCL | 3V3 | GND | FP2 | GND | GND | +5V | FP3 | 3V3 | 5V | SCK | SDA | FP4 | 3V3 | GND | MOS | SCL | SDA | RST | SCL | FP5 | SDA | D7 | SCL | I2C | D6 | I2 | FP6 | SPI | I1 | FP7 | TELEINO | Phase | GPB0 | Fusible | NO | COM | NF | Ant